# Altium schematic sheet SAMA7G54_PMIC.SchDoc
size 420 x 297 mm; SheetNumber: 9; SheetTotal: 32
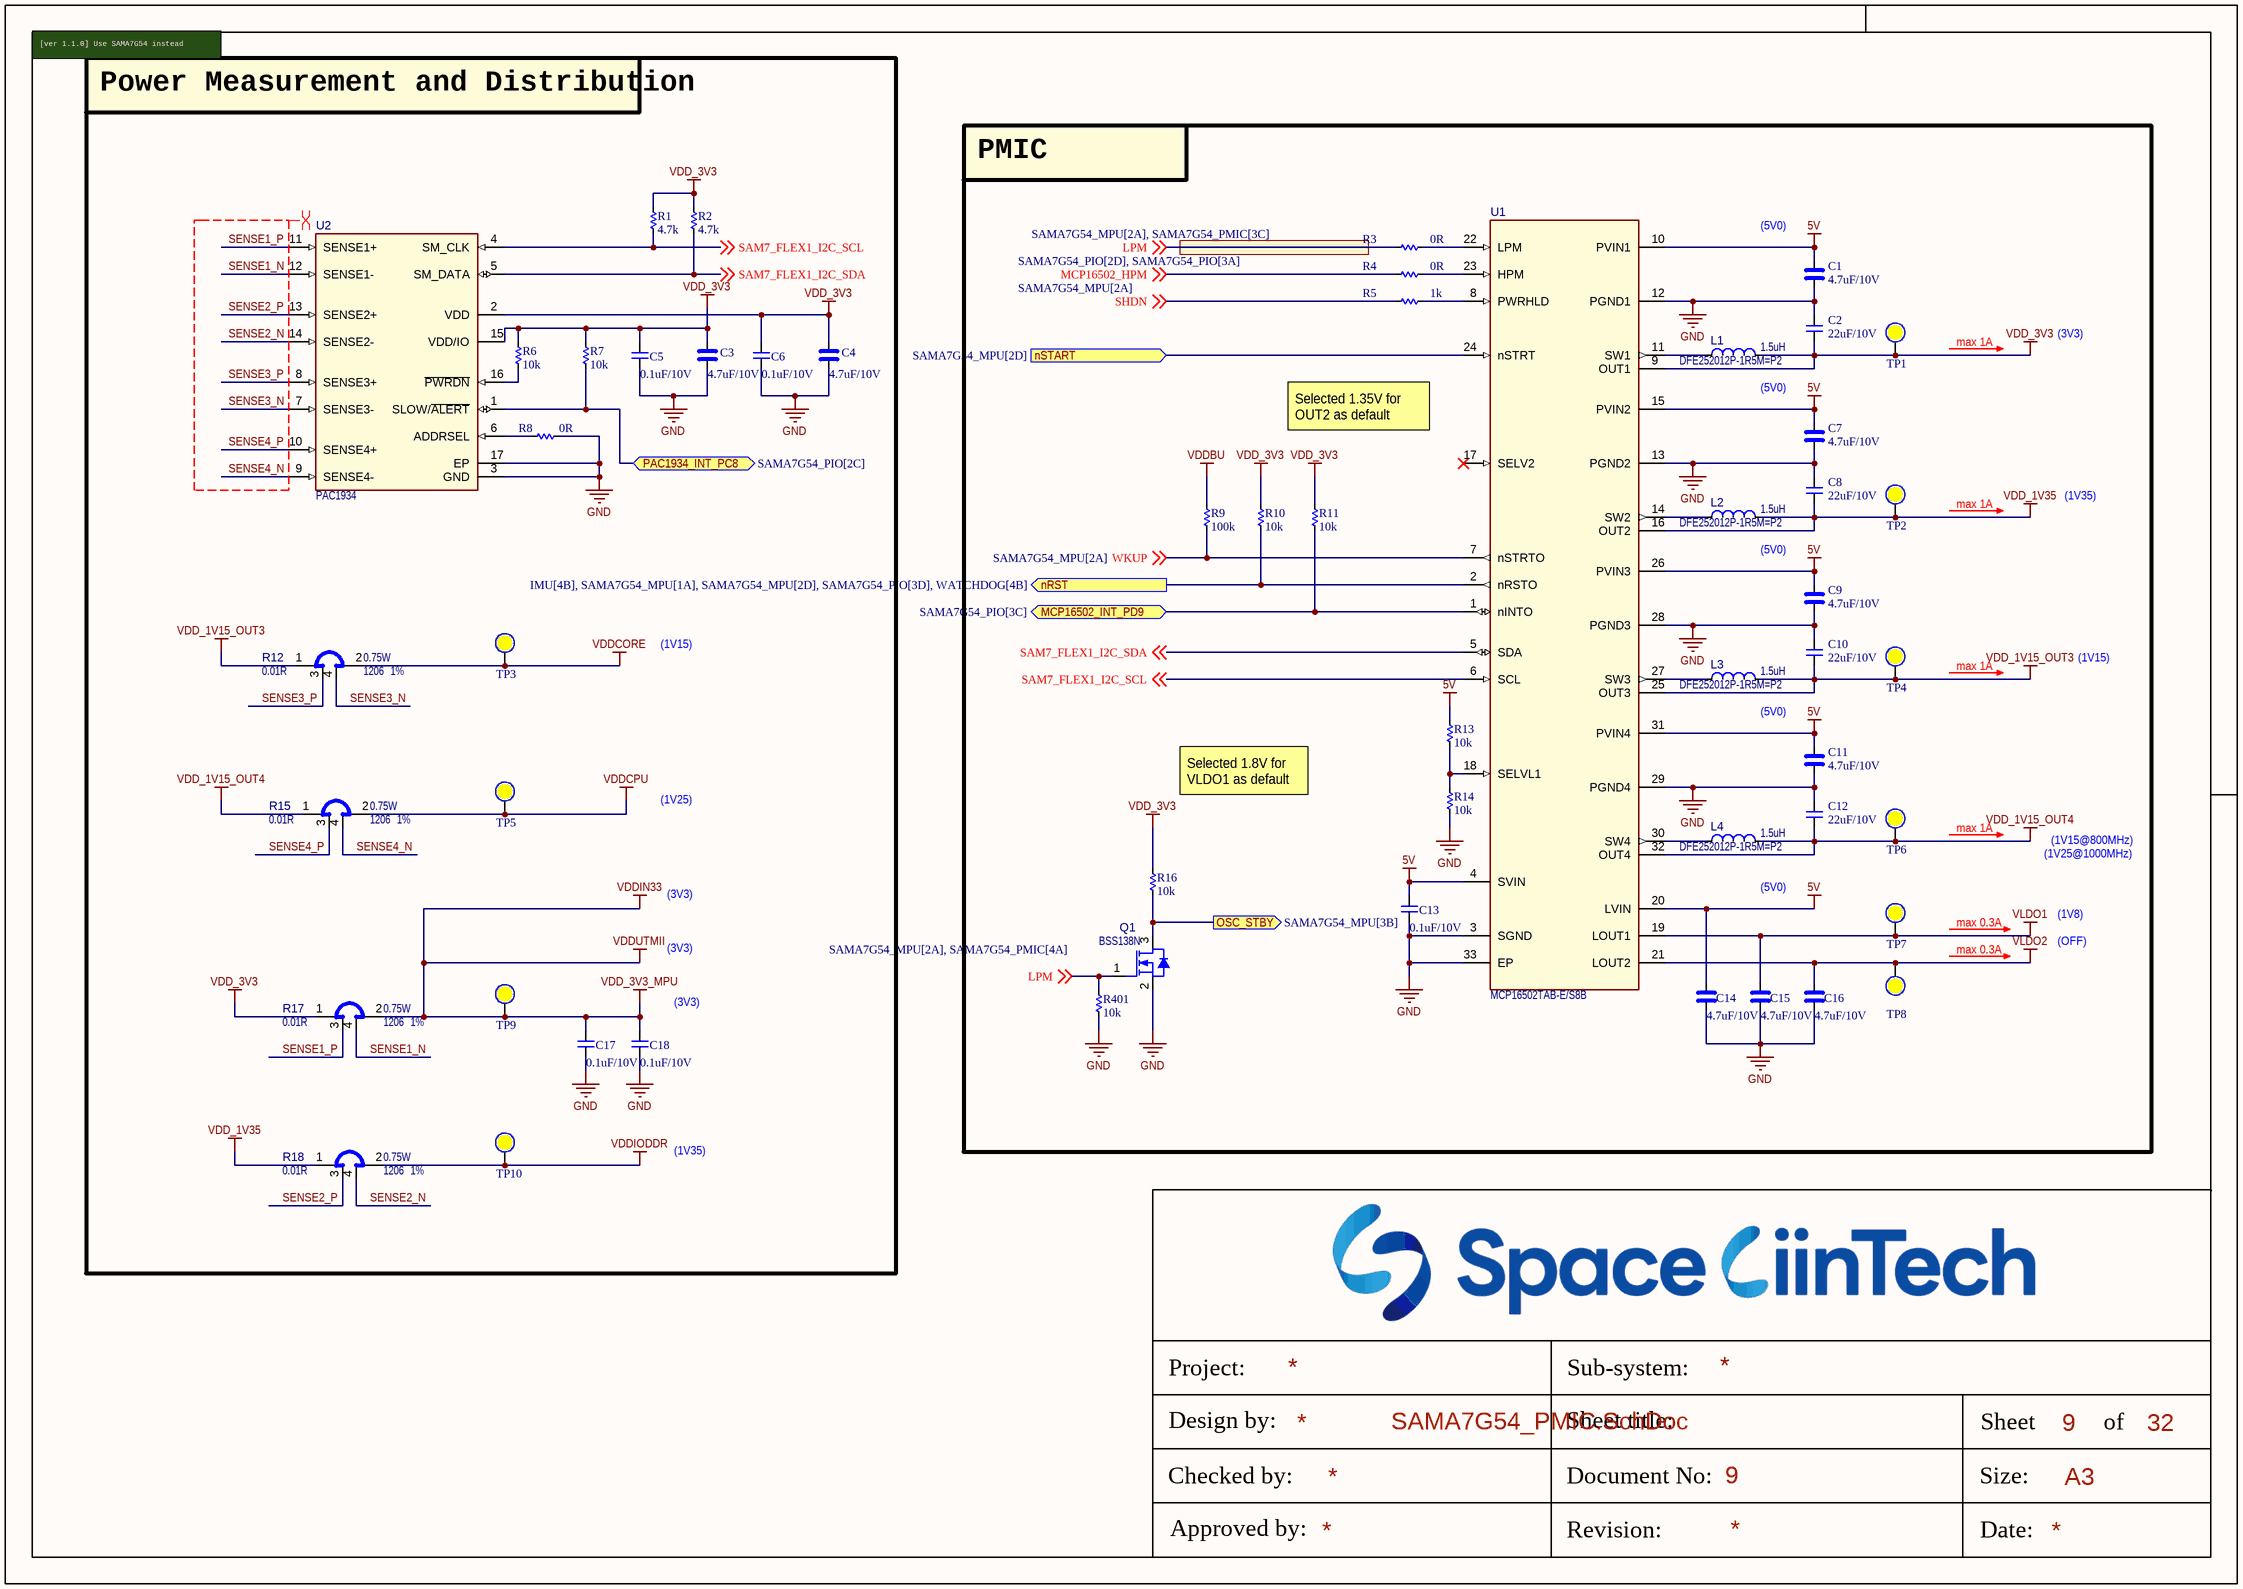
[diagram p0: SAMA7G54_PMIC.SchDoc]

## Parts
C1  4.7uF/10V  [CAP_C_1005X50_L]
C2  22uF/10V  [CAP_C_1608X80]
C3  4.7uF/10V  [CAP_C_1005X50_L]
C4  4.7uF/10V  [CAP_C_1005X50_L]
C5  0.1uF/10V  [CAP_C_1005X50_L]
C6  0.1uF/10V  [CAP_C_1005X50_L]
C7  4.7uF/10V  [CAP_C_1005X50_L]
C8  22uF/10V  [CAP_C_1608X80]
C9  4.7uF/10V  [CAP_C_1005X50_L]
C10  22uF/10V  [CAP_C_1608X80]
C11  4.7uF/10V  [CAP_C_1005X50_L]
C12  22uF/10V  [CAP_C_1608X80]
C13  0.1uF/10V  [CAP_C_1005X50_L]
C14  4.7uF/10V  [CAP_C_1005X50_L]
C15  4.7uF/10V  [CAP_C_1005X50_L]
C16  4.7uF/10V  [CAP_C_1005X50_L]
C17  0.1uF/10V  [CAP_C_1005X50_L]
C18  0.1uF/10V  [CAP_C_1005X50_L]
L1  value 1.5uH  [IND_C_1008]  (hidden comment: DFE252012P-1R5M=P2)
L2  value 1.5uH  [IND_C_1008]  (hidden comment: DFE252012P-1R5M=P2)
L3  value 1.5uH  [IND_C_1008]  (hidden comment: DFE252012P-1R5M=P2)
L4  value 1.5uH  [IND_C_1008]  (hidden comment: DFE252012P-1R5M=P2)
Q1  value BSS138N  [SOT-23-3]  (hidden comment: BSS138NH6327XTSA2)
R1  4.7k  [RES_C_1005x30_L]
R2  4.7k  [RES_C_1005x30_L]
R3  0R  [RES_C_1005x30_L]
R4  0R  [RES_C_1005x30_L]
R5  1k  [RES_C_1005x30_L]
R6  10k  [RES_C_1005x30_L]
R7  10k  [RES_C_1005x30_L]
R8  0R  [RES_C_1005x30_L]
R9  100k  [RES_C_1005x30_L]
R10  10k  [RES_C_1005x30_L]
R11  10k  [RES_C_1005x30_L]
R12  value 0.01R  Package: 1206  Tolerance: 1%  Power: 0.75W  [RES_C_1206_SHUNT]  (hidden comment: KRL1632E-M-R010-F-T5)
R13  10k  [RES_C_1005x30_L]
R14  10k  [RES_C_1005x30_L]
R15  value 0.01R  Package: 1206  Tolerance: 1%  Power: 0.75W  [RES_C_1206_SHUNT]  (hidden comment: KRL1632E-M-R010-F-T5)
R16  10k  [RES_C_1005x30_L]
R17  value 0.01R  Package: 1206  Tolerance: 1%  Power: 0.75W  [RES_C_1206_SHUNT]  (hidden comment: KRL1632E-M-R010-F-T5)
R18  value 0.01R  Package: 1206  Tolerance: 1%  Power: 0.75W  [RES_C_1206_SHUNT]  (hidden comment: KRL1632E-M-R010-F-T5)
R401  10k  [RES_C_1005x30_L]
TP1  (no value)  [Testpoint_80_pin0]  (no BOM)
TP2  (no value)  [Testpoint_80_pin0]  (no BOM)
TP3  (no value)  [Testpoint_80_pin0]  (no BOM)
TP4  (no value)  [Testpoint_80_pin0]  (no BOM)
TP5  (no value)  [Testpoint_80_pin0]  (no BOM)
TP6  (no value)  [Testpoint_80_pin0]  (no BOM)
TP7  (no value)  [Testpoint_80_pin0]  (no BOM)
TP8  (no value)  [Testpoint_80_pin0]  (no BOM)
TP9  (no value)  [Testpoint_80_pin0]  (no BOM)
TP10  (no value)  [Testpoint_80_pin0]  (no BOM)
U1  value MCP16502TAB-E/S8B  [QFN-32_5X5_EP3.7X3.7]  (hidden comment: MCP16502 QFN-32)
U2  value PAC1934  [UQFN-16_4X4_EP2.6X2.6]  (hidden comment: PAC1934 UQFN-16)

## Blocks framed on the sheet
Power Measurement and Distribution: C3-C6 C17 C18 R1 R2 R6-R8 R12 R15 R17 R18 TP3 TP5 TP9 TP10 U2
PMIC: C1 C2 C7-C16 L1-L4 Q1 R3-R5 R9-R11 R13 R14 R16 R401 TP1 TP2 TP4 TP6-TP8 U1

## Ports
MCP16502_INT_PD9 (bidir, see SAMA7G54_PIO[3C]), nRST (out, see IMU[4B], SAMA7G54_MPU[1A], SAMA7G54_MPU[2D], SAMA7G54_PIO[3D], WATCHDOG[4B]), nSTART (in, see SAMA7G54_MPU[2D]), OSC_STBY (out, see SAMA7G54_MPU[3B]), PAC1934_INT_PC8 (bidir, see SAMA7G54_PIO[2C])

## Nets
5V: C1.1 C7.1 C9.1 C11.1 C13.1 C14.1 R13.1 U1.4(SVIN) U1.10(PVIN1) U1.15(PVIN2) U1.20(LVIN) U1.26(PVIN3) U1.31(PVIN4)
GND: C1.2 C2.1 C3.2 C4.2 C5.2 C6.2 C7.2 C8.1 C9.2 C10.1 C11.2 C12.1 C13.2 C14.2 C15.2 C16.2 C17.2 C18.2 Q1.2(S) R8.2 R14.2 R401.2 U1.3(SGND) U1.12(PGND1) U1.13(PGND2) U1.28(PGND3) U1.29(PGND4) U1.33(EP) U2.3(GND) U2.17(EP)
VDD_1V15_OUT3: C10.2 L3.2(F) R12.1 TP4.0 U1.25(OUT3)
VDD_1V15_OUT4: C12.2 L4.2(F) R15.1 TP6.0 U1.32(OUT4)
VDD_1V35: C8.2 L2.2(F) R18.1 TP2.0 U1.16(OUT2)
VDD_3V3: C2.2 C3.1 C4.1 C5.1 C6.1 L1.2(F) R1.1 R2.1 R6.1 R7.1 R10.2 R11.2 R16.1 R17.1 TP1.0 U1.9(OUT1) U2.2(VDD) U2.15(VDD/IO)
VDD_3V3_MPU: C17.1 C18.1 R17.2 TP9.0  [also labelled VDDIN33, VDDUTMII]
VDDBU: R9.2
VDDCORE: R12.2 TP3.0
VDDCPU: R15.2 TP5.0
VDDIODDR: R18.2 TP10.0
VLDO1: C15.1 TP7.0 U1.19(LOUT1)
VLDO2: C16.1 TP8.0 U1.21(LOUT2)
LPM: Q1.1(G) R3.1 R401.1 ; off-sheet LPM
MCP16502_HPM: R4.1 ; off-sheet MCP16502_HPM
MCP16502_INT_PD9: R11.1 U1.1(nINTO) ; port MCP16502_INT_PD9
nRST: R10.1 U1.2(nRSTO) ; port nRST
nSTART: U1.24(nSTRT) ; port nSTART
OSC_STBY: Q1.3(D) R16.2 ; port OSC_STBY
PAC1934_INT_PC8: R7.2 U2.1(SLOW/~{ALERT}) ; port PAC1934_INT_PC8
SAM7_FLEX1_I2C_SCL: R1.2 U1.6(SCL) U2.4(SM_CLK) ; off-sheet SAM7_FLEX1_I2C_SCL
SAM7_FLEX1_I2C_SDA: R2.2 U1.5(SDA) U2.5(SM_DATA) ; off-sheet SAM7_FLEX1_I2C_SDA
SENSE1_N: R17.4 U2.12(SENSE1-)
SENSE1_P: R17.3 U2.11(SENSE1+)
SENSE2_N: R18.4 U2.14(SENSE2-)
SENSE2_P: R18.3 U2.13(SENSE2+)
SENSE3_N: R12.4 U2.7(SENSE3-)
SENSE3_P: R12.3 U2.8(SENSE3+)
SENSE4_N: R15.4 U2.9(SENSE4-)
SENSE4_P: R15.3 U2.10(SENSE4+)
SHDN: R5.1 ; off-sheet SHDN
WKUP: R9.1 U1.7(nSTRTO) ; off-sheet WKUP
NetL1_1: L1.1(S) U1.11(SW1)
NetL2_1: L2.1(S) U1.14(SW2)
NetL3_1: L3.1(S) U1.27(SW3)
NetL4_1: L4.1(S) U1.30(SW4)
NetR3_2: R3.2 U1.22(LPM)
NetR4_2: R4.2 U1.23(HPM)
NetR5_2: R5.2 U1.8(PWRHLD)
NetR6_2: R6.2 U2.16(~{PWRDN})
NetR8_1: R8.1 U2.6(ADDRSEL)
NetR13_2: R13.2 R14.1 U1.18(SELVL1)

Not connected (* = marked no-connect by the designer): U1 17(SELV2)*

## Layout directives
differential pair: SENSE1_N, SENSE1_P, SENSE2_N, SENSE2_P, SENSE3_N, SENSE3_P, SENSE4_N, SENSE4_P

## Notes on the sheet
- [ver 1.1.0] Use SAMA7G54 instead
- (near C1) (5V0)
- (5V0)
- max 1A
- (3V3)
- Selected 1.35V for OUT2 as default
- (1V35)
- (1V15)
- (1V25)
- Selected 1.8V for VLDO1 as default
- (1V25@1000MHz)
- (1V15@800MHz)
- (near L4) (5V0)
- max 0.3A
- (1V8)
- (OFF)
- (near C18) (3V3)
- Project:
- Sub-system:
- Design by:
- Sheet title:
- Sheet
- A3
- of
- Checked by:
- Approved by:
- Revision:
- Document No:
- Size:
- Date:

## Library data of the parts
C1 C3 C4 C7 C9 C11 C14-C16 = _CAP_C_High_2: CAP
C2 C5 C6 C8 C10 C12 C13 C17 C18 = _CAP_C_2: CAP
L1-L4 = IND1335: Inductor; Manufacturer 1: Murata Electronics North America; Description_: INDUCTOR 1.5uH 3.5A 20% SMD 1008; Dev Tools Status: Design; Owner: Razvan Cristescu; DCR: 0.06R; RMS Current: 3.5A; Test Frequency: 1MHz; Populated: YES; MCHP-ID: IND1335; Revision: A; Symbol: Inductor; Status: MCL Design; ComponentLink1URL: https://chn-vm-apps.microchip.com/mchprepo/parts/Datasheets/m_dfe252012p.pdf; ComponentLink1Description: SVN Datasheet; ComponentLink2URL: C:\ALTIUM_WORK\00001_MCHP-CDB\Datasheets\m_dfe252012p.pdf; ComponentLink2Description: Local Datasheet; ComponentLink3URL: C:\ALTIUM_WORK\00001_MCHP-CDB\Library\LibraryRefs\Inductor.SchLib; ComponentLink3Description: Open Symbol; ComponentLink4URL: C:\ALTIUM_WORK\00001_MCHP-CDB\Library\Footprints\IND_C_1008.PcbLib; ComponentLink4Description: Open Footprint; ComponentLink5Description: Open Footprint 2; ComponentLink6Description: Open Footprint 3; ComponentLink7Description: Open Footprint 4; Package: 1008; Type: Inductor; Category: Inductor; Manufacturer Part Number 1: DFE252012P-1R5M=P2; Supplier 1: Digi-Key; Supplier Part Number 1: 490-10648-6-ND; Quantity Override: 1
Q1 = TRA1223: Transistor MOS; Manufacturer 1: Infineon Technologies; Description_: TRANS FET N-CH BSS138N 60V 230mA SOT23-3; Dev Tools Status: Production; Type: FET; Current: 230mA; Drain to Source Voltage: 60V; Gate to Source Voltage: 20V; Power: 0.36W; Owner: Dragos Danaila; Populated: YES; MCHP-ID: TRA1223; Revision: 1; Symbol: Transistor MOS-N GSD; Status: MCL Design; Package: SOT23-3; ComponentLink1URL: https://chn-vm-apps.microchip.com/mchprepo/parts/Datasheets/Infineon-BSS138N-DS-v02_86-en.pdf; ComponentLink1Description: SVN Datasheet; ComponentLink2URL: C:\ALTIUM_WORK\00001_MCHP-CDB\Datasheets\Infineon-BSS138N-DS-v02_86-en.pdf; ComponentLink2Description: Local Datasheet; ComponentLink3URL: C:\ALTIUM_WORK\00001_MCHP-CDB\Library\LibraryRefs\Transistor MOS-N GSD.SchLib; ComponentLink3Description: Open Symbol; ComponentLink4URL: C:\ALTIUM_WORK\00001_MCHP-CDB\Library\Footprints\SOT-23-3.PcbLib; ComponentLink4Description: Open Footprint; ComponentLink5Description: Open Footprint 2; ComponentLink6Description: Open Footprint 3; ComponentLink7Description: Open Footprint 4; Operating Temperature: -55C to +150C; Category: Transistor; Voltage: 60V; Manufacturer Part Number 1: BSS138NH6327XTSA2; Supplier 1: Digi-Key; Supplier Part Number 1: BSS138NH6327XTSA2CT-ND; Quantity Override: 1
R1-R11 R13 R14 R16 R401 = _RES_B_2: RES
R12 R15 R17 R18 = RSMT1316: Shunt; Manufacturer 1: SUSUMU; Description_: RES SHUNT MF 0.01R 1% 0.75W SMD 1206; Dev Tools Status: Design; Temperature Coeffcient: 50ppm/C; Current: 8A; Owner: Ciprian Abramov; Populated: YES; MCHP-ID: RSMT1316; Revision: 1; Symbol: Shunt 4 Pin; Status: MCL Design; ComponentLink1URL: https://chn-vm-apps.microchip.com/mchprepo/parts/Datasheets/n_catalog_partition09_en.pdf; ComponentLink1Description: SVN Datasheet; ComponentLink2URL: C:\ALTIUM_WORK\00001_MCHP-CDB\Datasheets\n_catalog_partition09_en.pdf; ComponentLink2Description: Local Datasheet; ComponentLink3URL: C:\ALTIUM_WORK\00001_MCHP-CDB\Library\LibraryRefs\Shunt 4 Pin.SchLib; ComponentLink3Description: Open Symbol; ComponentLink4URL: C:\ALTIUM_WORK\00001_MCHP-CDB\Library\Footprints\RES_C_1206_SHUNT.PcbLib; ComponentLink4Description: Open Footprint; ComponentLink5Description: Open Footprint 2; ComponentLink6Description: Open Footprint 3; ComponentLink7Description: Open Footprint 4; Operating Temperature: -55C to +155C; Category: Resistor; Type: RES SMD; Composition: MF; Manufacturer Part Number 1: KRL1632E-M-R010-F-T5; Supplier 1: Digi-Key; Supplier Part Number 1: 408-1570-1-ND; Quantity Override: 1
TP1-TP10 = Test Point: Solder: NF
U1 = MIC8878: Manufacturer 1: Microchip Technology; Populated: YES; Description_: MCHP ANALOG PMIC SWITCHER Buck ADJ MCP16502TAB-E/S8B QFN-32 for SAMA7G5 MPU with LPDDR/DDR2/DDR3; Dev Tools Status: Design; Owner: Dragos Danaila; MCHP-ID: MIC8878; Symbol: MCP16502 QFN-32; Type: Switcher; Status: MCL Design; Revision: 1; Category: MCHP-Analog; ComponentLink1Description: SVN Datasheet; ComponentLink2Description: Local Datasheet; ComponentLink3URL: C:\ALTIUM_WORK\00001_MCHP-CDB\Library\LibraryRefs\MCP16502 QFN-32.SchLib; ComponentLink3Description: Open Symbol; ComponentLink4URL: C:\ALTIUM_WORK\00001_MCHP-CDB\Library\Footprints\QFN-32_5X5_EP3.7X3.7.PcbLib; ComponentLink4Description: Open Footprint; ComponentLink5Description: Open Footprint 2; ComponentLink6Description: Open Footprint 3; ComponentLink7Description: Open Footprint 4; Manufacturer Part Number 1: MCP16502TAB-E/S8B; Supplier 1: Digi-Key; Supplier Part Number 1: 150-MCP16502TAB-E/S8BCT-ND; Quantity Override: 1; ComponentLink2URL: C:\ALTIUM_WORK\00001_MCHP-CDB\Datasheets\MCP16502-High-Performance-PMIC-for-SAMA5DX-SAM9X6-MPUs-Data-Sheet-DS20006275B.pdf
U2 = MIC8883: Manufacturer 1: Microchip Technology; Manufacturer Part Number 1: PAC1934T-I/JQ; Description_: MCHP ANALOG POWER CURRENT SENSE MONITOR PAC1934T-I/JQ UQFN-16; Dev Tools Status: Design; Owner: Ciprian Abramov; Populated: YES; MCHP-ID: MIC8883; Symbol: PAC1934 UQFN-16; Type: Power/Current Sensor; Status: MCL Design; Revision: 1; Category: MCHP-Analog; ComponentLink1Description: SVN Datasheet; ComponentLink2Description: Local Datasheet; ComponentLink3URL: C:\ALTIUM_WORK\00001_MCHP-CDB\Library\LibraryRefs\PAC1934 UQFN-16.SchLib; ComponentLink3Description: Open Symbol; ComponentLink4URL: C:\ALTIUM_WORK\00001_MCHP-CDB\Library\Footprints\UQFN-16_4X4_EP2.6X2.6.PcbLib; ComponentLink4Description: Open Footprint; ComponentLink5Description: Open Footprint 2; ComponentLink6Description: Open Footprint 3; ComponentLink7Description: Open Footprint 4; Supplier 1: Digi-Key; Supplier Part Number 1: PAC1934T-I/JQCT-ND; Quantity Override: 1